# Altium schematic sheet Connectors.SchDoc
size Tabloid; Date: Date; Author: Author 1; DocumentNumber: 2; Revision: 1; SheetNumber: 2; SheetTotal: 7; Size: 11x17; Sheet_Name: Connectors
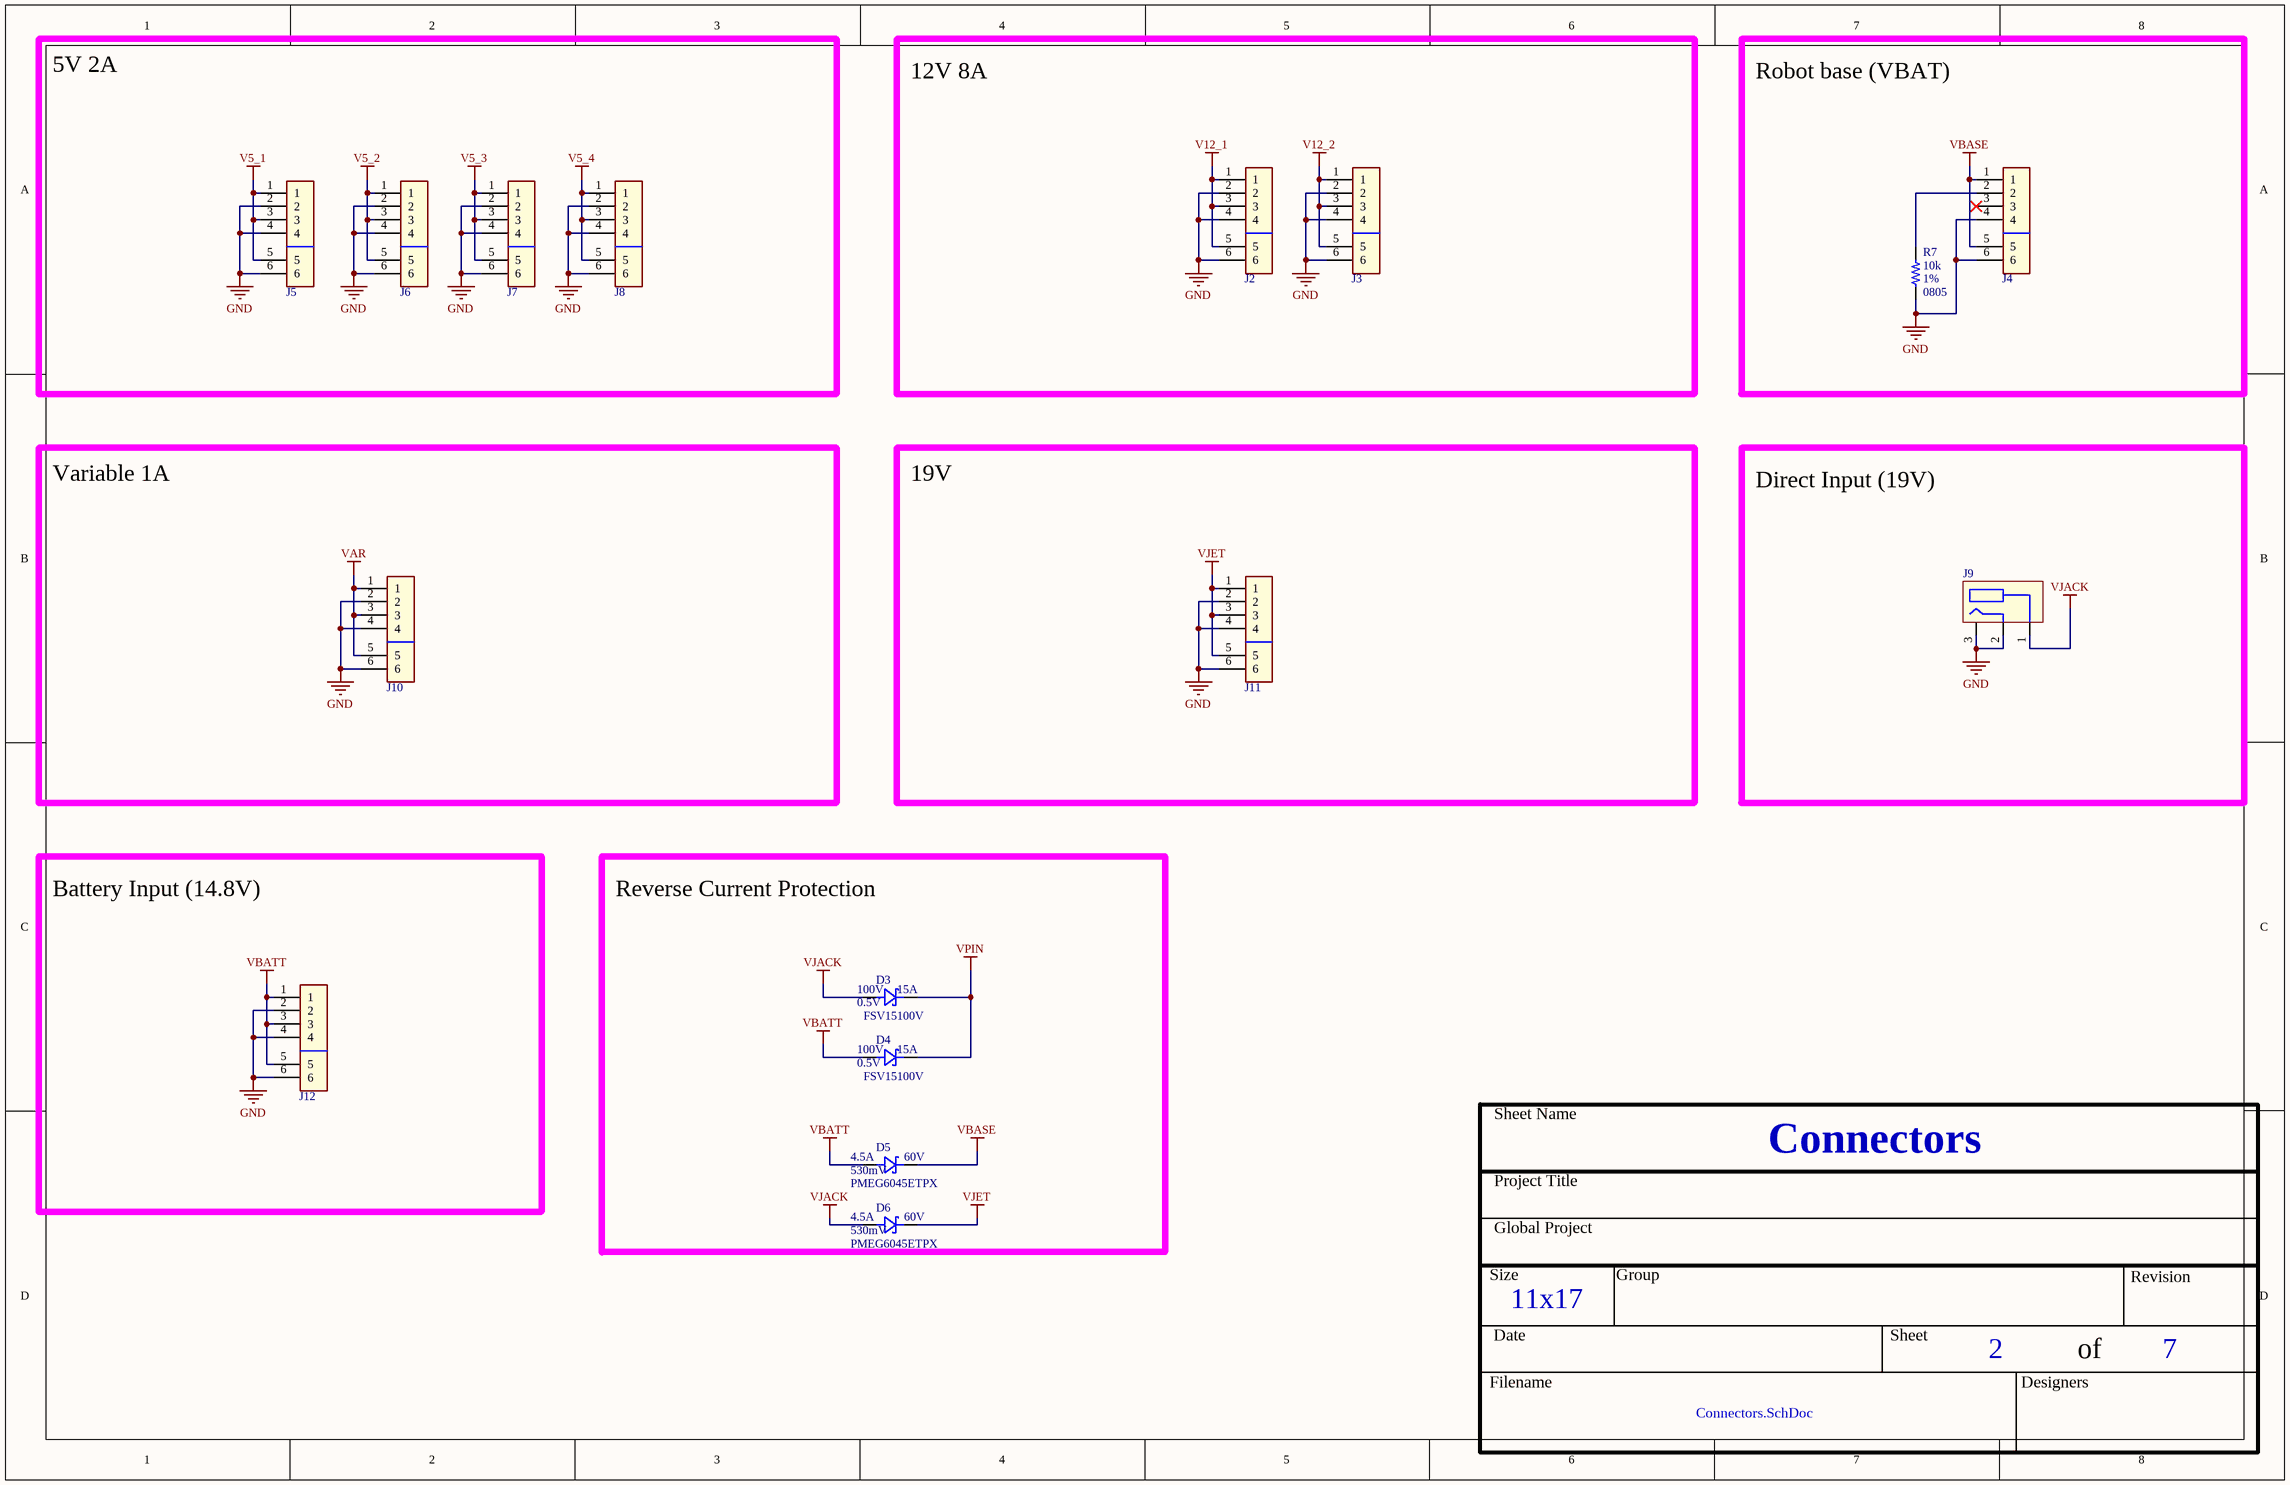
[diagram p0: Connectors.SchDoc]

## Parts
D3  Voltage: 100V  Current: 15A  Vf: 0.5V  Part number: FSV15100V  [TO277-3]  (hidden comment: DIODE_SCH_FSV15100V)
D4  Voltage: 100V  Current: 15A  Vf: 0.5V  Part number: FSV15100V  [TO277-3]  (hidden comment: DIODE_SCH_FSV15100V)
D5  Voltage: 60V  Current: 4.5A  Vf: 530mV  Part number: PMEG6045ETPX  [DO-214AC_SOD128]  (hidden comment: DIODE_SCH_PMEG6045ETPX)
D6  Voltage: 60V  Current: 4.5A  Vf: 530mV  Part number: PMEG6045ETPX  [DO-214AC_SOD128]  (hidden comment: DIODE_SCH_PMEG6045ETPX)
J2  MOLEX 4 POS - TERMINAL BLOCK 2 POS  [MOLEX4POS_TERMBLOCK2POS]  (value not drawn)
J3  MOLEX 4 POS - TERMINAL BLOCK 2 POS  [MOLEX4POS_TERMBLOCK2POS]  (value not drawn)
J4  MOLEX 4 POS - TERMINAL BLOCK 2 POS  [MOLEX4POS_TERMBLOCK2POS]  (value not drawn)
J5  MOLEX 4 POS - TERMINAL BLOCK 2 POS  [MOLEX4POS_TERMBLOCK2POS]  (value not drawn)
J6  MOLEX 4 POS - TERMINAL BLOCK 2 POS  [MOLEX4POS_TERMBLOCK2POS]  (value not drawn)
J7  MOLEX 4 POS - TERMINAL BLOCK 2 POS  [MOLEX4POS_TERMBLOCK2POS]  (value not drawn)
J8  MOLEX 4 POS - TERMINAL BLOCK 2 POS  [MOLEX4POS_TERMBLOCK2POS]  (value not drawn)
J9  Barrel 5.5x2.5mm  [Barrel 5.5mm 2.5mm]  (value not drawn)
J10  MOLEX 4 POS - TERMINAL BLOCK 2 POS  [MOLEX4POS_TERMBLOCK2POS]  (value not drawn)
J11  MOLEX 4 POS - TERMINAL BLOCK 2 POS  [MOLEX4POS_TERMBLOCK2POS]  (value not drawn)
J12  MOLEX 4 POS - TERMINAL BLOCK 2 POS  [MOLEX4POS_TERMBLOCK2POS]  (value not drawn)
R7  value 10k  Tolerance: 1%  Package: 0805  [FER_0805]  (hidden comment: RES - 0805)

## Blocks framed on the sheet
5V 2A: J5-J8
12V 8A: J2 J3
Robot base (VBAT): J4 R7
Variable 1A: J10
19V: J11
Direct Input (19V): J9
Battery Input (14.8V): J12
Reverse Current Protection: D3-D6

## Nets
GND: J2.2 J2.4 J2.6 J3.2 J3.4 J3.6 J4.4 J4.6 J5.2 J5.4 J5.6 J6.2 J6.4 J6.6 J7.2 J7.4 J7.6 J8.2 J8.4 J8.6 J9.2 J9.3 J10.2 J10.4 J10.6 J11.2 J11.4 J11.6 J12.2 J12.4 J12.6 R7.2
V5_1: J5.1 J5.3 J5.5
V5_2: J6.1 J6.3 J6.5
V5_3: J7.1 J7.3 J7.5
V5_4: J8.1 J8.3 J8.5
V12_1: J2.1 J2.3 J2.5
V12_2: J3.1 J3.3 J3.5
VAR: J10.1 J10.3 J10.5
VBASE: D5.2 J4.1 J4.5
VBATT: D4.1 D5.1 J12.1 J12.3 J12.5
VJACK: D3.1 D6.1 J9.1
VJET: D6.2 J11.1 J11.3 J11.5
VPIN: D3.2 D4.2
NetJ4_2: J4.2 R7.1

Not connected (* = marked no-connect by the designer): J4 3*

## Notes on the sheet
- Sheet Name
- Project Title
- Global Project
- Size
- Group
- Revision
- Date
- Sheet
- of
- Filename
- Designers

## Library data of the parts
D3 D4 = DIODE_SCH_FSV15100V: Diode Schottky 60V 4.5A Surface Mount CFP5; Package: TO-277-3
D5 D6 = DIODE_SCH_PMEG6045ETPX: Diode Schottky 60V 4.5A Surface Mount CFP5; Package: SOD-128
J2-J8 J10-J12 = MOLEX 4 POS - TERMINAL BLOCK 2 POS: Part number: 0039281043; Part number: OSTOQ023250
J9 = Barrel 5.5x2.5mm: Jack 5.5x2.5mm; Part number: PJ-082BH
R7 = RES - 0805: Part number: RMCF0805FT10K0; Watt: ? W